# EAGLE design Sensor_laser_board_V_1_0 (EAGLE 9.6.2)
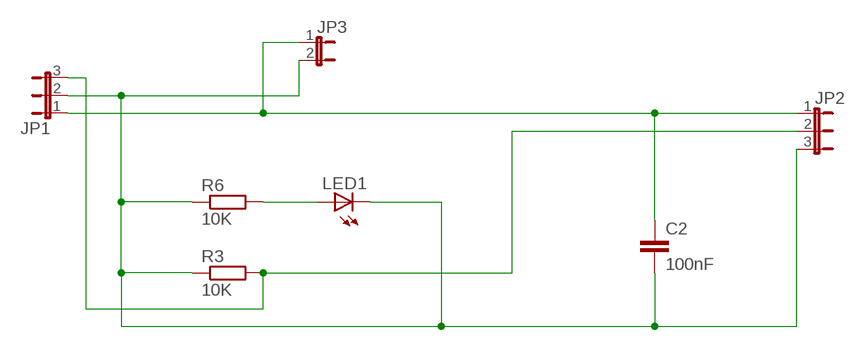
[diagram p0: schematic, sheet 1]

## Parts
C2  100nF  C-EU025_050-025X075  [C025_050-025X075]
JP1  JP2E  [JP2]
JP2  JP2E  [JP2]
JP3  JP1E  [JP1]
LED1  LED3MM  [LED3MM]
R3  10K  R-EU_0309/10  [0309/10]
R6  10K  R-EU_0309/10  [0309/10]

## Nets
GND: C2.1 JP1.1 JP2.1 JP3.1
N$1: C2.2 JP1.2 JP2.3 JP3.2 LED1.K(C) R3.1 R6.1
N$3: LED1.A R6.2
N$4: JP1.3 JP2.2 R3.2

## Library data of the parts
C2 = resistor:C-EU: CAPACITOR, European symbol
JP1 JP2 = jumper:JP2E: JUMPER
JP3 = jumper:JP1E: JUMPER
LED1 = adafruit:LED: LED OSRAM: - CHIPLED LG R971, LG N971, LY N971, LG Q971, LY Q971, LO R971, LY R971 LH N974, LH R974 LS Q976, LO Q976, LY Q976 LO Q996 - Hyper CHIPLED LW Q18S LB Q993, LB Q99A, LB R99A - SideLED LS A670, LO A670, LY A670, LG A670, LP A670 LB A673, LV A673, LT A673, LW A673 LH A674 LY A675 LS A676, LA A676, LO A676, LY A676, LW A676 LS A679, LY A679, LG A679 - Hyper Micro SIDELED® LS Y876, LA Y876, LO Y876, LY Y876 LT Y87S - SmartLED LW L88C, LW L88S LB L89C, LB L89S, LG L890 LS L89K, LO L89K, LY L89K LS L896, LA L896, LO L896, LY L896 - TOPLED LS T670, LO T670, LY T670, LG T670, LP T670 LSG T670, LSP T670, LSY T670, LOP T670, LYG T670 LG T671, LOG T671, LSG T671 LB T673, LV T673, LT T673, LW T673 LH T674 LS T676, LA T676, LO T676, LY T676, LB T676, LH T676, LSB T676, LW T676 LB T67C, LV T67C, LT T67C, LS T67K, LO T67K, LY T67K, LW E67C LS E67B, LA E67B, LO E67B, LY E67B, LB E67C, LV E67C, LT E67C LW T67C LS T679, LY T679, LG T679 LS T770, LO T770, LY T770, LG T770, LP T770 LB T773, LV T773, LT T773, LW T773 LH T774 LS E675, LA E675, LY E675, LS T675 LS T776, LA T776, LO T776, LY T776, LB T776 LHGB T686 LT T68C, LB T68C - Hyper Mini TOPLED® LB M676 - Mini TOPLED Santana® LG M470 LS M47K, LO M47K, LY M47K Source: http://www.osram.convergy.de/
R3 R6 = resistor:R-EU_: RESISTOR, European symbol

## Board
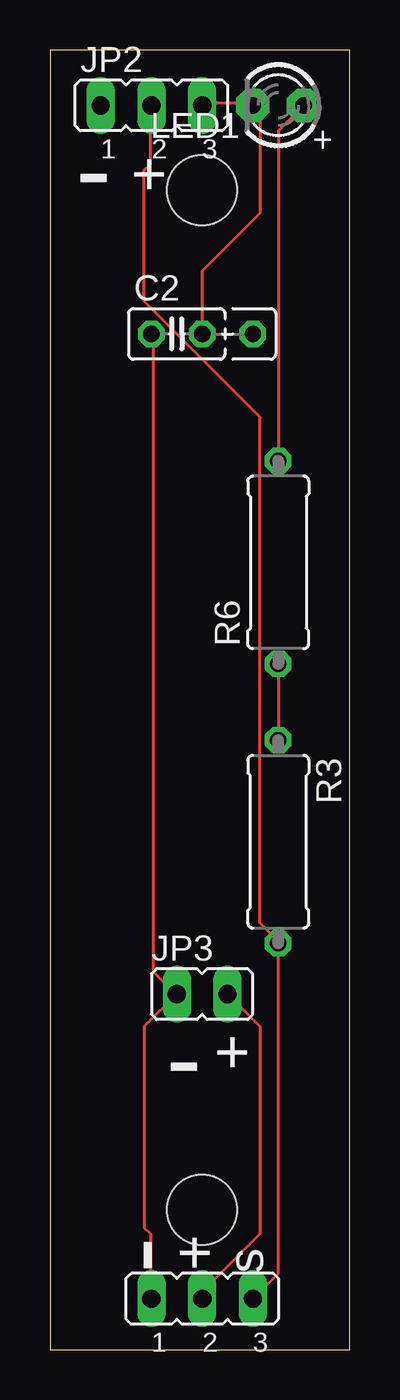
[diagram p1: board, top side]
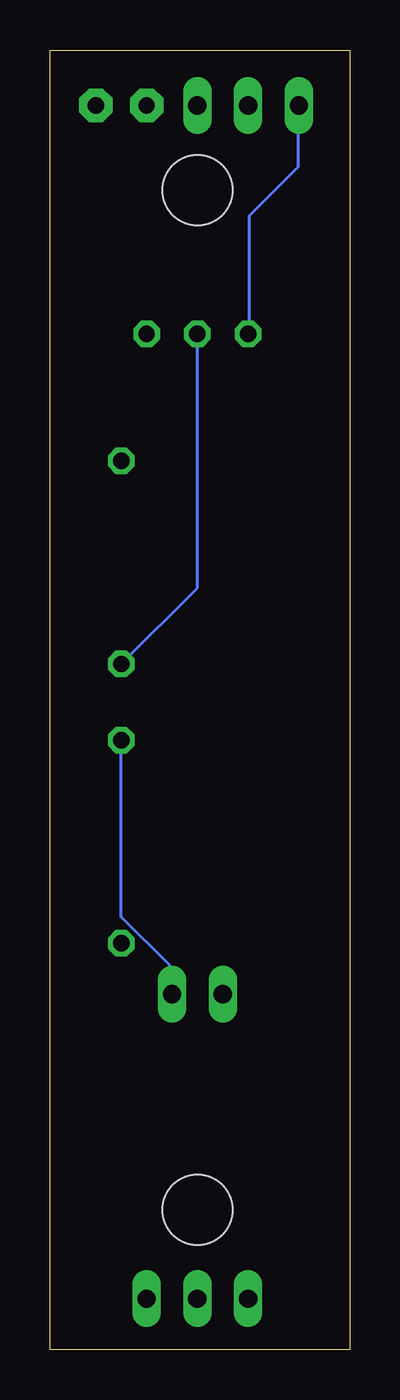
[diagram p2: board, bottom side, seen from below]

Size 15 x 65 mm. Coordinates in mm from the lower left corner, seen from the top.
Outline: 0,0 15,0 15,65 0,65 0,0
Copper layers (1*16): Top 0.035mm / dielectric 1.5mm / Bottom 0.035mm
Design rules "default": minimum track width 6mil, minimum drill 0.35mm, track to track 6mil, track to pad 6mil, pad to pad 6mil, via to via 6mil, smd to smd 6mil, copper to edge 40mil, drill to drill 6mil, minimum pad ring 10mil, minimum via ring 8mil, stop-mask expansion 4mil, vias tented up to drill 0mil, thermal gap 10mil
Holes 3.5 mm at 7.62,58 7.62,7

### Footprints (pad centres in the part's own frame; a part is rotated, then mirrored left to right if it is on the bottom)
C025_050-025X075 = drill 0.813 octagon: 1 -1.27,0; 2 1.27,0; 3 3.81,0
JP2 = drill 0.914 long: 1 -2.54,0; 2 0,0; 3 2.54,0
JP1 = drill 0.914 long: 1 0,-1.27; 2 0,1.27
LED3MM = drill 0.813 pad 1.676 octagon: A -1.27,0; K 1.27,0
0309/10 = drill 0.813 octagon: 1 -5.08,0; 2 5.08,0

### Placement (x,y rotation side)
C2  6.35,50.8 0 top
JP1  7.62,2.54 0 top
JP2  5.08,62.23 0 top
JP3  7.62,17.78 270 top
LED1  11.43,62.23 180 top
R3  11.43,25.4 270 top
R6  11.43,39.37 90 top

### Tracks (layer width: path | path; a pad name or v marks a point on that pad's centre or on a via)
GND
  Top 0.152: JP1.1 5.03,2.59 5.03,5.79 4.72,6.1 4.72,16.15 JP3.1 6.25,17.83 5.18,18.9 5.18,50.75 C2.1
  Bottom 0.152: C2.1 5.03,50.9 5.03,56.69 2.59,59.13 2.59,62.18 JP2.1
N$1
  Top 0.152: C2.2 7.62,53.95 10.52,56.84 10.52,61.87 LED1.K 10.06,62.33 7.62,62.33 JP2.3 | R6.1 R3.1 | JP1.2 7.62,2.9 10.52,5.79 10.52,16.15 JP3.2
  Bottom 0.152: R3.1 11.43,21.64 8.99,19.2 8.99,17.83 JP3.2 | C2.2 7.62,38.1 R6.1
N$3
  Top 0.152: R6.2 11.43,60.96 LED1.A
N$4
  Top 0.152: JP1.3 11.43,3.81 R3.2 11.43,20.42 10.52,21.34 10.52,46.63 4.72,52.43 4.72,58.98 5.03,59.28 5.03,62.18 JP2.2

### Text on the board
tNames: + | - | - | + | s | + | -